# EAGLE design TIC TAC PCB1 (EAGLE 9.6.2)
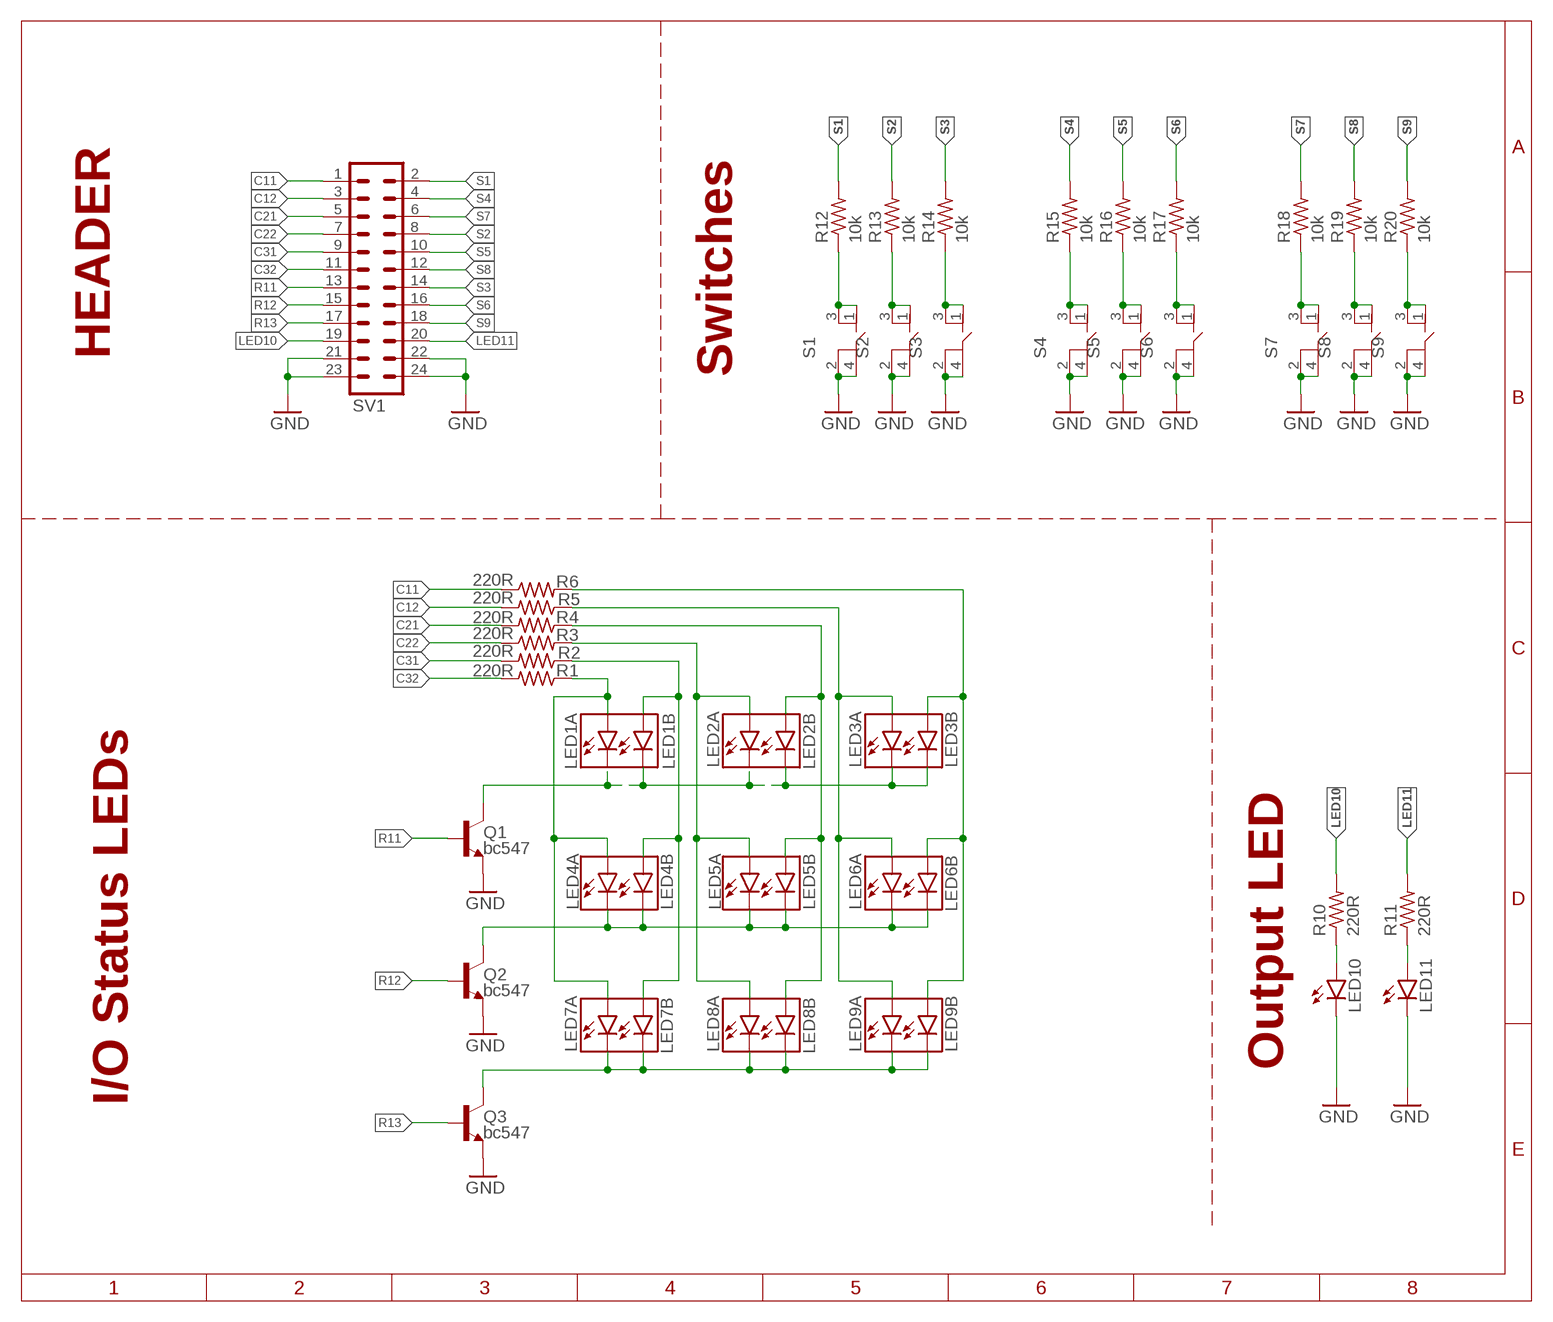
[diagram p0: schematic, sheet 1]

## Parts
LED1A  LEDSML0805  [SML0805]
LED1B  LEDSML0805  [SML0805]
LED2A  LEDSML0805  [SML0805]
LED2B  LEDSML0805  [SML0805]
LED3A  LEDSML0805  [SML0805]
LED3B  LEDSML0805  [SML0805]
LED4A  LEDSML0805  [SML0805]
LED4B  LEDSML0805  [SML0805]
LED5A  LEDSML0805  [SML0805]
LED5B  LEDSML0805  [SML0805]
LED6A  LEDSML0805  [SML0805]
LED6B  LEDSML0805  [SML0805]
LED7A  LEDSML0805  [SML0805]
LED7B  LEDSML0805  [SML0805]
LED8A  LEDSML0805  [SML0805]
LED8B  LEDSML0805  [SML0805]
LED9A  LEDSML0805  [SML0805]
LED9B  LEDSML0805  [SML0805]
LED10  LEDSMT1206  [1206]
LED11  LEDSMT1206  [1206]
Q1  bc547  TRANS_NPN-MMBT2222AL  [SOT23-3]
Q2  bc547  TRANS_NPN-MMBT2222AL  [SOT23-3]
Q3  bc547  TRANS_NPN-MMBT2222AL  [SOT23-3]
R1  220R  R-US_M0805  [M0805]
R2  220R  R-US_M0805  [M0805]
R3  220R  R-US_M0805  [M0805]
R4  220R  R-US_M0805  [M0805]
R5  220R  R-US_M0805  [M0805]
R6  220R  R-US_M0805  [M0805]
R10  220R  R-US_M0805  [M0805]
R11  220R  R-US_M0805  [M0805]
R12  10k  R-US_M0805  [M0805]
R13  10k  R-US_M0805  [M0805]
R14  10k  R-US_M0805  [M0805]
R15  10k  R-US_M0805  [M0805]
R16  10k  R-US_M0805  [M0805]
R17  10k  R-US_M0805  [M0805]
R18  10k  R-US_M0805  [M0805]
R19  10k  R-US_M0805  [M0805]
R20  10k  R-US_M0805  [M0805]
S1  TS04-66-95-BK-100-SMT  [SW_TS04-66-95-BK-100-SMT]
S2  TS04-66-95-BK-100-SMT  [SW_TS04-66-95-BK-100-SMT]
S3  TS04-66-95-BK-100-SMT  [SW_TS04-66-95-BK-100-SMT]
S4  TS04-66-95-BK-100-SMT  [SW_TS04-66-95-BK-100-SMT]
S5  TS04-66-95-BK-100-SMT  [SW_TS04-66-95-BK-100-SMT]
S6  TS04-66-95-BK-100-SMT  [SW_TS04-66-95-BK-100-SMT]
S7  TS04-66-95-BK-100-SMT  [SW_TS04-66-95-BK-100-SMT]
S8  TS04-66-95-BK-100-SMT  [SW_TS04-66-95-BK-100-SMT]
S9  TS04-66-95-BK-100-SMT  [SW_TS04-66-95-BK-100-SMT]
SV1  MA12-2  [MA12-2]

## Nets
C11: R6.1 SV1.1
C12: R5.2 SV1.3
C21: R4.2 SV1.5
C22: R3.1 SV1.7
C31: R2.2 SV1.9
C32: R1.2 SV1.11
GND: LED10.C LED11.C Q1.2(E) Q2.2(E) Q3.2(E) S1.2 S1.4 S2.2 S2.4 S3.2 S3.4 S4.2 S4.4 S5.2 S5.4 S6.2 S6.4 S7.2 S7.4 S8.2 S8.4 S9.2 S9.4 SV1.21 SV1.22 SV1.23 SV1.24
LED10: R10.2 SV1.19
LED11: R11.2 SV1.20
N$2: LED1B.A LED4B.A LED7B.A R2.1
N$3: R12.1 S1.1 S1.3
N$4: R13.1 S2.1 S2.3
N$5: R14.1 S3.1 S3.3
N$6: R15.1 S4.1 S4.3
N$7: R16.1 S5.1 S5.3
N$8: R17.1 S6.1 S6.3
N$9: R18.1 S7.1 S7.3
N$10: R19.1 S8.1 S8.3
N$11: R20.1 S9.1 S9.3
N$12: LED2B.A LED5B.A LED8B.A R4.1
N$13: LED3B.A LED6B.A LED9B.A R6.2
N$23: LED2A.A LED5A.A LED8A.A R3.2
N$24: LED3A.A LED6A.A LED9A.A R5.1
N$30: LED1A.A LED4A.A LED7A.A R1.1
N$31: LED10.A R10.1
N$32: LED11.A R11.1
N$39: LED1A.C LED1B.C LED2A.C LED2B.C LED3A.C LED3B.C Q1.3(C)
N$41: LED4A.C LED4B.C LED5A.C LED5B.C LED6A.C LED6B.C Q2.3(C)
N$46: LED7A.C LED7B.C LED8A.C LED8B.C LED9A.C LED9B.C Q3.3(C)
R11: Q1.1(B) SV1.13
R12: Q2.1(B) SV1.15
R13: Q3.1(B) SV1.17
S1: R12.2 SV1.2
S2: R13.2 SV1.8
S3: R14.2 SV1.14
S4: R15.2 SV1.4
S5: R16.2 SV1.10
S6: R17.2 SV1.16
S7: R18.2 SV1.6
S8: R19.2 SV1.12
S9: R20.2 SV1.18

## Notes on the sheet
- HEADER
- Switches
- Output LED
- I/O Status LEDs

## Library data of the parts
LED1A LED1B LED2A LED2B LED3A LED3B LED4A LED4B LED5A LED5B LED6A LED6B LED7A LED7B LED8A LED8B LED9A LED9B LED10 LED11 = led:LED: LED OSRAM: - CHIPLED LG R971, LG N971, LY N971, LG Q971, LY Q971, LO R971, LY R971 LH N974, LH R974 LS Q976, LO Q976, LY Q976 LO Q996 - Hyper CHIPLED LW Q18S LB Q993, LB Q99A, LB R99A - SideLED LS A670, LO A670, LY A670, LG A670, LP A670 LB A673, LV A673, LT A673, LW A673 LH A674 LY A675 LS A676, LA A676, LO A676, LY A676, LW A676 LS A679, LY A679, LG A679 - Hyper Micro SIDELED® LS Y876, LA Y876, LO Y876, LY Y876 LT Y87S - SmartLED LW L88C, LW L88S LB L89C, LB L89S, LG L890 LS L89K, LO L89K, LY L89K LS L896, LA L896, LO L896, LY L896 - TOPLED LS T670, LO T670, LY T670, LG T670, LP T670 LSG T670, LSP T670, LSY T670, LOP T670, LYG T670 LG T671, LOG T671, LSG T671 LB T673, LV T673, LT T673, LW T673 LH T674 LS T676, LA T676, LO T676, LY T676, LB T676, LH T676, LSB T676, LW T676 LB T67C, LV T67C, LT T67C, LS T67K, LO T67K, LY T67K, LW E67C LS E67B, LA E67B, LO E67B, LY E67B, LB E67C, LV E67C, LT E67C LW T67C LS T679, LY T679, LG T679 LS T770, LO T770, LY T770, LG T770, LP T770 LB T773, LV T773, LT T773, LW T773 LH T774 LS E675, LA E675, LY E675, LS T675 LS T776, LA T776, LO T776, LY T776, LB T776 LHGB T686 LT T68C, LB T68C - Hyper Mini TOPLED® LB M676 - Mini TOPLED Santana® LG M470 LS M47K, LO M47K, LY M47K Source: http://www.osram.convergy.de LUXEON: - LUMILED® LXK2-PW12-R00, LXK2-PW12-S00, LXK2-PW14-U00, LXK2-PW14-V00 LXK2-PM12-R00, LXK2-PM12-S00, LXK2-PM14-U00 LXK2-PE12-Q00, LXK2-PE12-R00, LXK2-PE12-S00, LXK2-PE14-T00, LXK2-PE14-U00 LXK2-PB12-K00, LXK2-PB12-L00, LXK2-PB12-M00, LXK2-PB14-N00, LXK2-PB14-P00, LXK2-PB14-Q00 LXK2-PR12-L00, LXK2-PR12-M00, LXK2-PR14-Q00, LXK2-PR14-R00 LXK2-PD12-Q00, LXK2-PD12-R00, LXK2-PD12-S00 LXK2-PH12-R00, LXK2-PH12-S00 LXK2-PL12-P00, LXK2-PL12-Q00, LXK2-PL12-R00 Source: www.luxeon.com KINGBRIGHT: KA-3528ASYC Source: www.kingbright.com
Q1-Q3 = SparkFun-DiscreteSemi:TRANS_NPN: NPN transistor Current controlled devices typically used to amplify current or used as a switch. BC547 - COM-08928 <http://www.sparkfun.com/products/8928> (TO-92 45V 100mA) (1.Collector 2.Base 3.Emitter) 2N3904 - COM-00521 <http://www.sparkfun.com/products/521> (TO-92 40V 200mA) (1.Emitter 2.Base 3.Collector) P2N2222A - COM-12852 <http://www.sparkfun.com/products/12852> (TO-92 40V 600mA) (1.Collector 2.Base 3.Emitter); PROD_ID: TRANS-08049; VALUE: 600mA/40V
R1-R6 R10-R20 = rcl:R-US_: RESISTOR, American symbol; SPICEPREFIX: R
S1-S9 = TS04-66-95-BK-100-SMT:TS04-66-95-BK-100-SMT: Check availability <https://pricing.snapeda.com/parts/TS04-66-95-BK-100-SMT/CUI%20Devices/view-part?ref=eda>; AVAILABILITY: In Stock; CUI_PURCHASE_URL: https://www.cuidevices.com/product/switches/tactile-switches/ts04-series?utm_source=snapeda.com&utm_medium=referral&utm_campaign=snapedaBOM; DESCRIPTION: 6 x 6 mm, 4.3~9.5 mm Actuator Height, 100~260 gf, Surface Mount, SPST, Tactile Switch; MF: CUI Devices; MP: TS04-66-95-BK-100-SMT; PACKAGE: None; PRICE: None; PURCHASE-URL: https://pricing.snapeda.com/search/part/TS04-66-95-BK-100-SMT/?ref=eda
SV1 = con-lstb:MA12-2: PIN HEADER; OC_FARNELL: unknown; OC_NEWARK: unknown

## Board
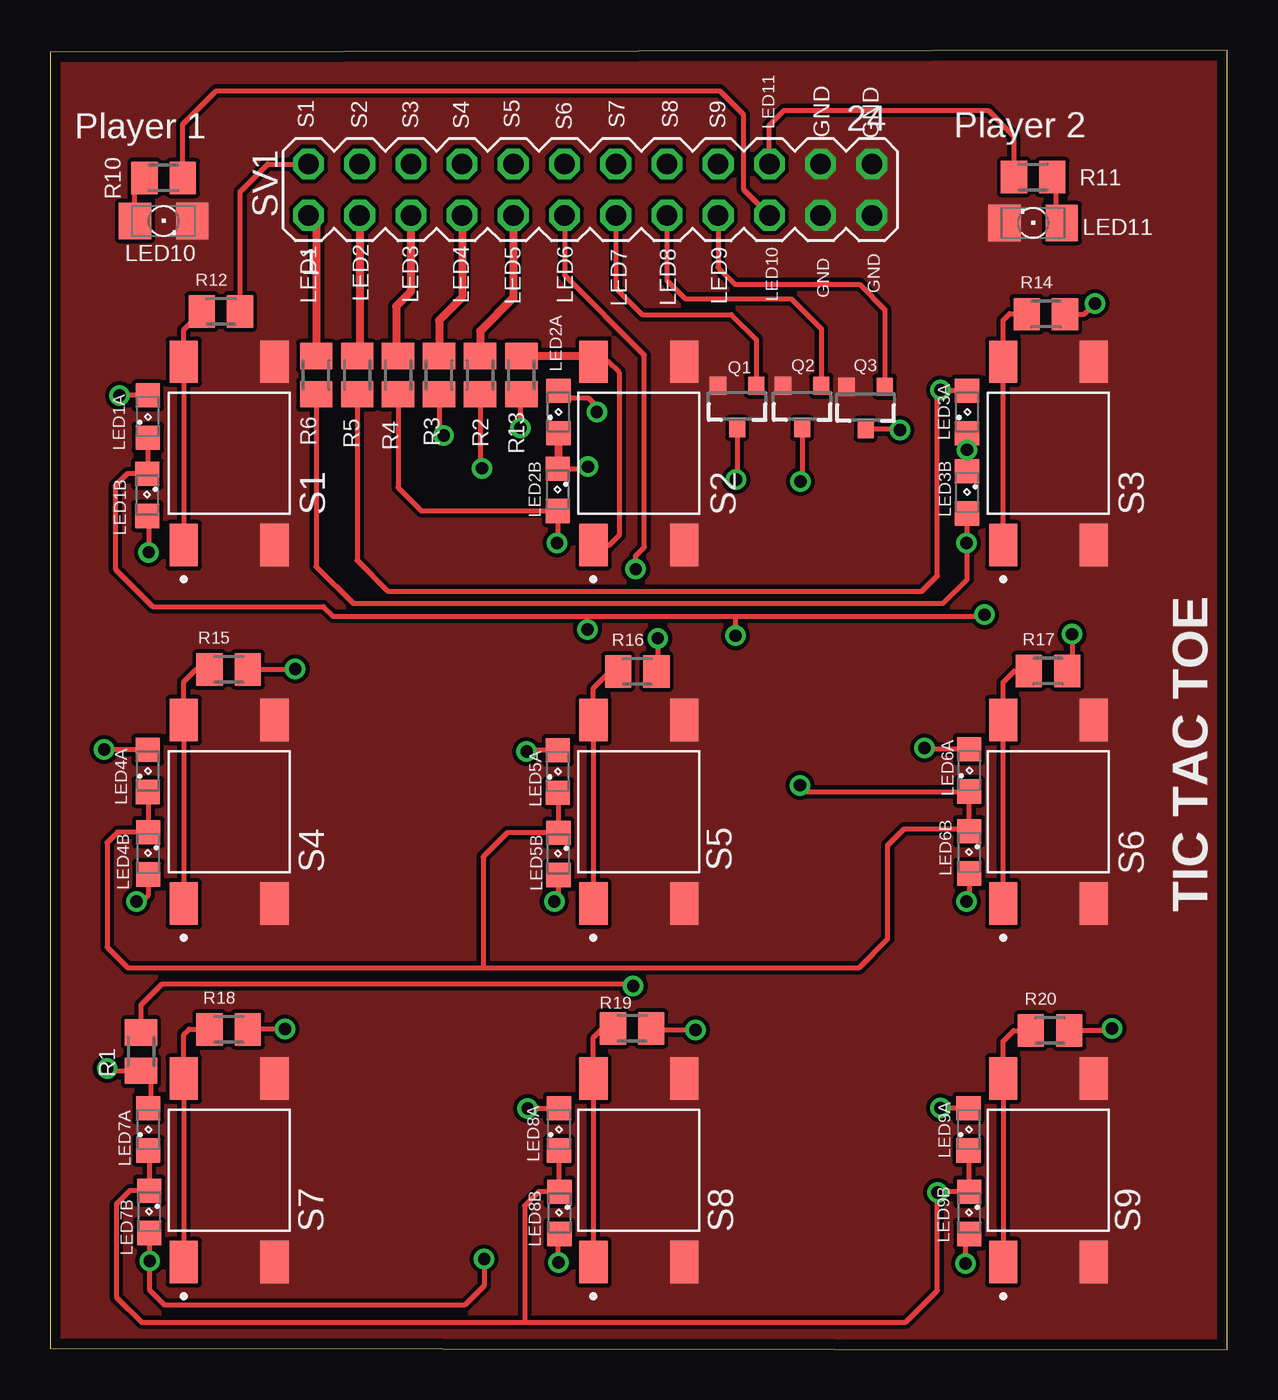
[diagram p1: board, top side]
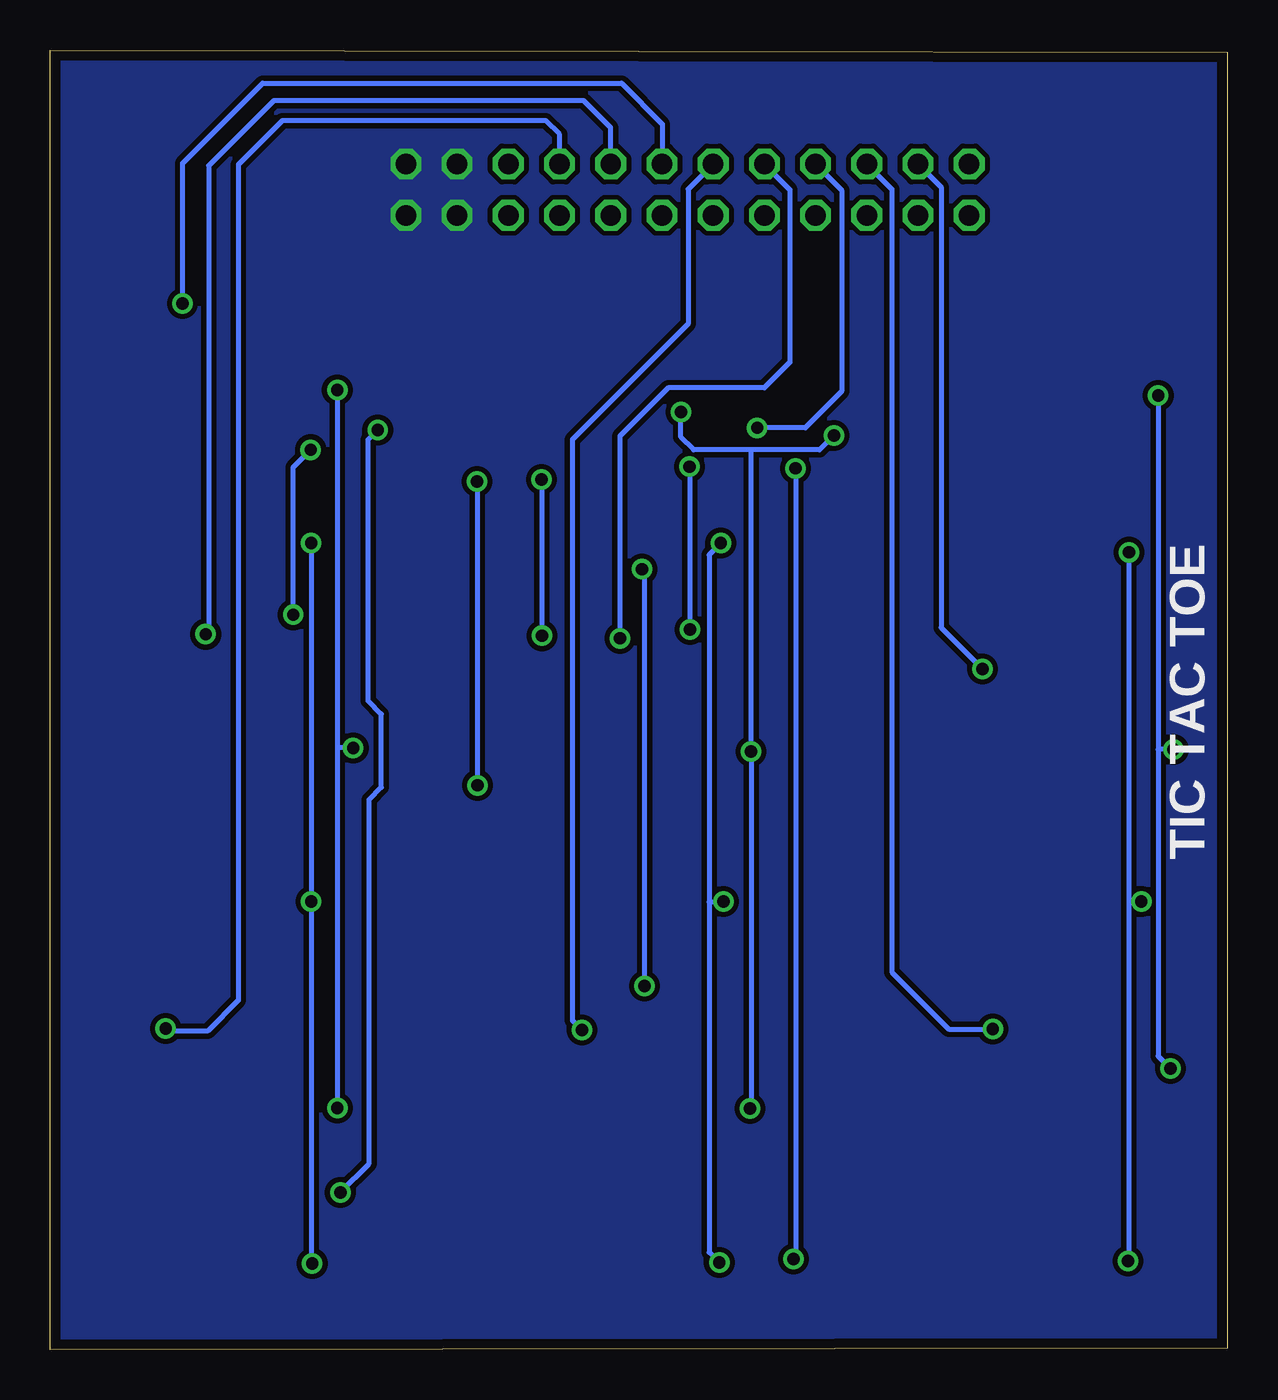
[diagram p2: board, bottom side, seen from below]

Size 58.37 x 64.44 mm. Coordinates in mm from the lower left corner, seen from the top.
Outline: 0,0.08 58.38,0 58.38,64.44 0,64.34 0,0.08
Copper layers (1*16): Top 0.035mm / dielectric 1mm / Bottom 0.035mm
Design rules "default *": minimum track width 10mil, minimum drill 24mil, track to track 8mil, track to pad 8mil, pad to pad 8mil, via to via 8mil, smd to smd 0mil, copper to edge 20mil, drill to drill 8mil, minimum pad ring 10mil, minimum via ring 8mil, stop-mask expansion 4mil, vias tented up to drill 0mil, thermal gap 10mil

### Footprints (pad centres in the part's own frame; a part is rotated, then mirrored left to right if it is on the bottom)
SML0805 = smd 1.2 x 1.2: A 1.05,0; C -1.05,0
1206 = smd 1.6 x 1.803: A -1.422,0; C 1.422,0
SOT23-3 = smd 0.8 x 0.9: 1 -0.95,-1; 2 0.95,-1; 3 0,1.1
M0805 = smd 1.3 x 1.6: 1 -0.95,0; 2 0.95,0
SW_TS04-66-95-BK-100-SMT = smd 2.1 x 1.4: 1 -4.55,2.25; 2 -4.55,-2.25; 3 4.55,2.25; 4 4.55,-2.25
MA12-2 = drill 1.016 octagon: 1 -13.97,-1.27; 2 -13.97,1.27; 3 -11.43,-1.27; 4 -11.43,1.27; 5 -8.89,-1.27; 6 -8.89,1.27; 7 -6.35,-1.27; 8 -6.35,1.27; 9 -3.81,-1.27; 10 -3.81,1.27; 11 -1.27,-1.27; 12 -1.27,1.27; 13 1.27,-1.27; 14 1.27,1.27; 15 3.81,-1.27; 16 3.81,1.27; 17 6.35,-1.27; 18 6.35,1.27; 19 8.89,-1.27; 20 8.89,1.27; 21 11.43,-1.27; 22 11.43,1.27; 23 13.97,-1.27; 24 13.97,1.27

### Placement (x,y rotation side)
LED1A  4.83,46.28 90 top
LED1B  4.8,42.39 270 top
LED2A  25.2,46.51 90 top
LED2B  25.17,42.65 270 top
LED3A  45.47,46.51 90 top
LED3B  45.47,42.52 270 top
LED4A  4.83,28.7 90 top
LED4B  4.85,24.61 270 top
LED5A  25.17,28.68 90 top
LED5B  25.2,24.59 270 top
LED6A  45.57,28.73 90 top
LED6B  45.57,24.66 270 top
LED7A  4.85,10.92 90 top
LED7B  4.9,6.83 270 top
LED8A  25.22,10.92 90 top
LED8B  25.25,6.78 270 top
LED9A  45.54,10.92 90 top
LED9B  45.57,6.78 270 top
LED10  5.61,55.98 0 top
LED11  48.74,55.88 180 top
Q1  34.06,46.81 180 top
Q2  37.29,46.81 180 top
Q3  40.44,46.76 180 top
R1  4.5,14.78 90 top
R2  21.31,48.34 90 top
R3  19.28,48.34 270 top
R4  17.25,48.34 90 top
R5  15.21,48.34 90 top
R6  13.18,48.34 270 top
R10  5.61,58.12 0 top
R11  48.74,58.17 180 top
R12  8.46,51.49 0 top
R13  23.37,48.34 270 top
R14  49.38,51.36 0 top
R15  8.84,33.73 0 top
R16  29.11,33.63 0 top
R17  49.48,33.66 0 top
R18  8.84,15.88 0 top
R19  28.85,15.93 0 top
R20  49.58,15.82 0 top
S1  8.86,44.45 90 top
S2  29.18,44.45 90 top
S3  49.5,44.45 90 top
S4  8.86,26.67 90 top
S5  29.18,26.67 90 top
S6  49.5,26.67 90 top
S7  8.86,8.89 90 top
S8  29.18,8.89 90 top
S9  49.5,8.89 90 top
SV1  26.77,57.53 0 top

### Tracks (layer width: path | path; a pad name or v marks a point on that pad's centre or on a via)
C11
  Top 0.406: SV1.1 13.18,55.88 R6.1
C12
  Top 0.406: SV1.3 15.34,49.41 R5.2
C21
  Top 0.406: SV1.5 17.88,52.48 17.14,51.74 17.14,49.39 R4.2
C22
  Top 0.406: SV1.7 20.42,52.2 19.28,51.05 R3.1
C31
  Top 0.406: SV1.9 22.96,52.17 21.31,50.52 R2.2
C32  (via drill 0.61)
  Top 0.254: SV1.11 25.5,53.29 29.46,49.33 29.46,39.8 29.03,39.37 v29.03,38.71 | R1.2 4.5,17.09 5.54,18.14 28.8,18.14 v28.91,18.03
  Bottom 0.254: v28.91,18.03 28.91,38.58 v29.03,38.71
GND
  pour Top (no thermals): -0.05,64.34 58.35,64.34 58.32,64.24 58.32,0.05 -0.05,0.07
  pour Bottom (isolate 0.254, no thermals): -0.05,64.34 58.37,64.34 58.37,0 -0.05,0
LED10
  Top 0.254: R10.2 6.56,60.77 8.23,62.43 33.2,62.43 34.37,61.27 34.37,57.56 SV1.19
  Top 0.305: 6.68,58.23 R10.2
LED11
  Top 0.254: SV1.20 35.66,60.73 36.4,61.47 46.51,61.47 47.79,60.18 R11.2
N$2  (via drill 0.61)
  Top 0.254: LED1B.A 4.88,41.27 v4.88,39.55 | LED7B.A 4.93,5.76 v4.93,4.39 4.93,2.95 5.66,2.21 20.55,2.21 21.51,3.18 v21.51,4.5 | LED4B.A 4.85,22.53 4.52,22.2 4.29,22.2 v4.27,22.23 | R2.1 21.31,43.82 v21.41,43.71
  Bottom 0.254: v4.88,39.55 4.88,22.2 | 4.88,22.2 4.88,4.45 v4.93,4.39 | v4.27,22.23 4.85,22.23 4.88,22.2 | v21.41,43.71 21.41,4.6 v21.51,4.5
N$3
  Top 0.254: S1.1 S1.3 6.62,50.59 R12.1
N$4
  Top 0.254: S2.1 27.72,39.9 28.2,40.38 28.2,48.47 27.67,49 S2.3
  Top 0.406: R13.1 26.65,49.29 S2.3
N$5
  Top 0.254: S3.1 47.26,48.67 | 47.26,48.67 S3.3 47.26,51.06 47.57,51.38 48.4,51.38 R14.1 | 47.17,48.58 47.26,48.67
N$6
  Top 0.254: S4.3 S4.1 | S4.3 6.62,30.64 | S4.3 6.62,33.13 7.21,33.73 R15.1
N$7
  Top 0.254: S5.3 26.8,31.22 26.39,30.81 26.38,30.83 | S5.3 26.93,32.81 27.75,33.63 R16.1 | S5.3 S5.1
N$8
  Top 0.254: S6.1 47.26,30.71 | 47.26,30.71 S6.3 47.26,33.11 47.8,33.66 R17.1 | 47.16,30.8 47.26,30.71
N$9
  Top 0.254: 6.62,13.13 S7.3 6.62,15.63 6.88,15.9 7.86,15.9 R18.1 | 6.62,13.13 S7.1 | 6.5,13.02 6.62,13.13
N$10
  Top 0.254: 26.52,13.02 S8.3 | S8.3 S8.1 | S8.3 26.93,15.48 27.38,15.93 R19.1
N$11
  Top 0.254: 46.84,13.02 S9.3 | S9.3 S9.1 | S9.3 47.26,15.3 47.78,15.82 R20.1
N$12  (via drill 0.61)
  Top 0.254: R4.1 17.25,42.75 18.4,41.6 LED2B.A 25.17,40.06 v25.12,40.01 | v25.2,4.32 25.2,5.68 LED8B.A | LED5B.A 25.2,22.43 v24.99,22.23
  Bottom 0.254: v25.12,40.01 25.7,39.42 25.7,22.2 | v25.2,4.32 25.7,4.83 25.7,22.2 | v24.99,22.23 25.02,22.2 25.7,22.2
N$13  (via drill 0.61)
  Top 0.254: LED3B.A 45.44,41.44 v45.44,40.01 45.47,39.98 45.47,38.2 44.27,37.01 15.01,37.01 13.18,38.84 R6.2 | v45.39,4.27 45.39,5.55 LED9B.A | LED6B.A 45.57,22.35 v45.44,22.23
  Bottom 0.254: v45.44,40.01 v45.44,22.23 45.44,4.32 v45.39,4.27
N$23  (via drill 0.61)
  Top 0.254: R3.2 19.28,45.57 v19.51,45.34 | v27.1,46.51 27.1,46.79 26.71,47.18 25.58,47.18 LED2A.A | LED5A.A 23.68,29.73 v23.62,29.67 | v23.67,11.96 23.68,11.97 LED8A.A
  Bottom 0.254: v19.51,45.34 20.22,44.63 23.57,44.63 | v27.1,46.51 27.1,45.26 26.47,44.63 23.57,44.63 | 23.57,44.63 23.62,44.58 v23.62,29.67 23.62,12.01 v23.67,11.96
N$24  (via drill 0.61)
  Top 0.254: LED3A.A 44.19,47.56 | 44.19,47.56 v44.15,47.6 | v44.15,11.99 45.52,11.99 LED9A.A | LED6A.A 43.42,29.78 v43.36,29.85 | R5.1 15.21,39.14 16.74,37.62 43.23,37.62 43.99,38.38 43.99,47.36 44.19,47.56
  Bottom 0.254: v44.15,47.6 44.15,29.85 | 44.15,29.85 v44.15,11.99 | v43.36,29.85 44.15,29.85
N$30  (via drill 0.61)
  Top 0.254: LED7A.A 4.98,12.1 4.98,13.35 R1.1 2.93,13.83 v2.82,13.94 | LED1A.A 3.44,47.33 v3.43,47.32 | LED4A.A 2.68,29.75 v2.67,29.77
  Bottom 0.254: v3.43,47.32 3.43,29.77 | 3.43,29.77 3.43,14.55 v2.82,13.94 | v2.67,29.77 3.43,29.77
N$31
  Top 0.254: LED10.A 4.19,57.64 R10.1
N$32
  Top 0.254: 49.69,56.35 LED11.A 49.89,56.16 49.89,58.67 49.69,58.48 R11.1
N$39  (via drill 0.61)
  Top 0.254: LED1A.C 4.83,43.47 LED1B.C 3.82,43.44 3.23,42.85 3.23,38.71 5.08,36.86 13.54,36.86 14.02,36.37 26.62,36.37 | LED3B.C v45.47,44.63 LED3A.C | v46.33,36.45 46.25,36.37 34.06,36.37 | 26.62,36.37 34.06,36.37 | LED2B.C 26.58,43.7 v26.67,43.79 | v26.64,35.71 26.62,35.74 26.62,36.37 | Q1.3 34.06,43.21 v34.01,43.15 | v33.98,35.41 33.98,36.3 34.06,36.37
  Top 0.406: LED2A.C 25.2,43.72 LED2B.C
  Bottom 0.254: v46.33,36.45 46.33,43.76 v45.47,44.63 | v26.67,43.79 26.67,35.74 v26.64,35.71 | v34.01,43.15 34.01,35.43 v33.98,35.41
N$41  (via drill 0.61)
  Top 0.254: LED4A.C 4.85,27.63 LED4B.C 3.34,25.66 2.82,25.15 2.82,19.96 3.83,18.95 21.46,18.95 | LED6B.C 45.57,25.83 | 45.57,25.83 LED6A.C 37.5,27.68 v37.19,27.99 | LED5A.C 25.2,27.6 LED5B.C 22.66,25.64 21.46,24.44 21.46,18.95 | 45.57,25.83 42.34,25.83 41.53,25.02 41.53,20.37 40.11,18.95 21.46,18.95 | Q2.3 37.29,43.13 v37.21,43.05
  Bottom 0.254: v37.21,43.05 37.21,28.02 v37.19,27.99
N$46  (via drill 0.61)
  Top 0.254: LED7A.C 4.9,9.82 LED7B.C 3.95,7.88 3.28,7.21 3.28,2.59 4.52,1.35 23.52,1.35 | LED8A.C 25.22,7.86 LED8B.C 24.21,7.83 23.52,7.14 23.52,1.35 | LED9A.C 45.54,7.86 LED9B.C 44.03,7.83 v43.99,7.8 43.99,2.92 42.42,1.35 23.52,1.35 | v42.14,45.62 42.1,45.66 Q3.3
  Bottom 0.254: v43.99,7.8 42.57,9.22 42.57,27.28 41.96,27.89 41.96,31.52 42.62,32.18 42.62,45.14 v42.14,45.62
R11
  Top 0.254: SV1.13 28.04,52.65 29.36,51.33 33.78,51.33 35.01,50.1 Q1.1
R12
  Top 0.254: SV1.15 30.58,53.04 31.5,52.12 36.75,52.12 38.24,50.64 Q2.1
R13
  Top 0.254: SV1.17 33.12,53.67 33.96,52.83 40.13,52.83 41.39,51.58 Q3.1
S1
  Top 0.254: R12.2 9.41,57.44 10.77,58.8 SV1.2
S2  (via drill 0.61)
  Top 0.254: v23.32,45.72 23.32,47.34 R13.2
  Bottom 0.254: SV1.8 19.13,57.51 19.13,47.52 20.93,45.72 v23.32,45.72
S3  (via drill 0.61)
  Top 0.254: v51.82,51.89 51.28,51.36 R14.2
  Bottom 0.254: v51.82,51.89 51.82,58.85 47.85,62.81 30.05,62.81 28.02,60.78 28.02,58.83 SV1.14
S4  (via drill 0.61)
  Top 0.254: v12.14,33.76 12.12,33.73 R15.2
  Bottom 0.254: SV1.4 14.2,57.66 14.2,35.81 v12.14,33.76
S5  (via drill 0.61)
  Top 0.254: v30.12,35.28 30.12,33.7 R16.2
  Bottom 0.254: SV1.10 21.69,57.53 21.69,48.97 22.96,47.7 27.74,47.7 30.12,45.31 v30.12,35.28
S6  (via drill 0.61)
  Top 0.254: v50.67,35.48 50.67,33.9 R17.2
  Bottom 0.254: SV1.16 30.58,60.6 31.93,61.95 47.3,61.95 50.52,58.73 50.52,35.64 v50.67,35.48
S7  (via drill 0.61)
  Top 0.254: v11.63,15.9 9.81,15.9 R18.2
  Bottom 0.254: SV1.6 16.64,57.56 16.64,18.72 13.82,15.9 v11.63,15.9
S8  (via drill 0.61)
  Top 0.254: v32,15.85 29.88,15.85 R19.2
  Bottom 0.254: SV1.12 26.75,57.56 26.75,50.88 32.49,45.14 32.49,16.33 v32,15.85
S9  (via drill 0.61)
  Top 0.254: v52.65,15.93 52.55,15.82 R20.2
  Bottom 0.254: SV1.18 33.12,60.27 33.81,60.96 46.86,60.96 49.05,58.78 49.05,17.32 50.57,15.8 52.53,15.8 v52.65,15.93

### Text on the board
tNames: LED11 | GND | GND | S1 | S2 | S3 | S4 | S5 | S6 | S7 | S8 | S9 | Player 1 | Player 2 | LED2 | GND | GND | LED1 | LED3 | LED4 | LED5 | LED6 | LED7 | LED8 | LED9 | LED10 | TIC TAC TOE
bNames: TIC TAC TOE